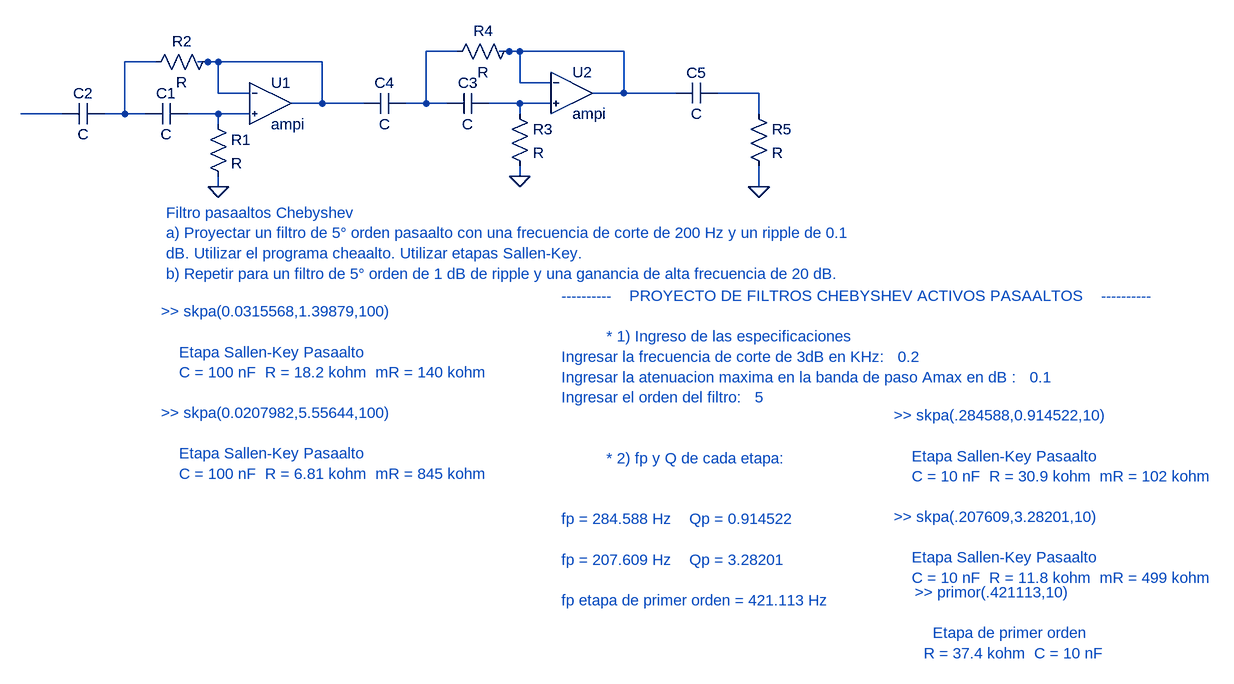
[diagram p0: schematic filtro_problema17_tp7.asc]
filtro_problema17_tp7.asc, the LTspice schematic file:
Version 4
SHEET 1 1504 724
WIRE 304 -208 256 -208
WIRE 384 -208 368 -208
WIRE 400 -208 384 -208
WIRE 560 -208 400 -208
WIRE -160 -192 -208 -192
WIRE -80 -192 -96 -192
WIRE -64 -192 -80 -192
WIRE 96 -192 -64 -192
WIRE 400 -160 400 -208
WIRE 448 -160 400 -160
WIRE -64 -144 -64 -192
WIRE -16 -144 -64 -144
WIRE 560 -144 560 -208
WIRE 560 -144 512 -144
WIRE 640 -144 560 -144
WIRE 768 -144 704 -144
WIRE 96 -128 96 -192
WIRE 96 -128 48 -128
WIRE 160 -128 96 -128
WIRE 256 -128 256 -208
WIRE 256 -128 224 -128
WIRE 288 -128 256 -128
WIRE 400 -128 352 -128
WIRE 448 -128 400 -128
WIRE -304 -112 -368 -112
WIRE -208 -112 -208 -192
WIRE -208 -112 -240 -112
WIRE -176 -112 -208 -112
WIRE -64 -112 -112 -112
WIRE -16 -112 -64 -112
WIRE 400 -112 400 -128
WIRE 768 -112 768 -144
WIRE -64 -96 -64 -112
WIRE 400 -16 400 -32
WIRE -64 0 -64 -16
WIRE 768 0 768 -32
FLAG -64 0 0
FLAG 400 -16 0
FLAG 768 0 0
SYMBOL Circuitos2\\ComponentesIdeales\\ampi 16 -192 R0
SYMATTR InstName U1
SYMBOL res -80 -112 R0
SYMATTR InstName R1
SYMBOL cap -112 -128 R90
WINDOW 0 0 32 VBottom 2
WINDOW 3 32 32 VTop 2
SYMATTR InstName C1
SYMBOL cap -240 -128 R90
WINDOW 0 0 32 VBottom 2
WINDOW 3 32 32 VTop 2
SYMATTR InstName C2
SYMBOL res -64 -208 R90
WINDOW 0 0 56 VBottom 2
WINDOW 3 32 56 VTop 2
SYMATTR InstName R2
SYMBOL Circuitos2\\ComponentesIdeales\\ampi 480 -208 R0
SYMATTR InstName U2
SYMBOL res 384 -128 R0
SYMATTR InstName R3
SYMBOL cap 352 -144 R90
WINDOW 0 0 32 VBottom 2
WINDOW 3 32 32 VTop 2
SYMATTR InstName C3
SYMBOL cap 224 -144 R90
WINDOW 0 0 32 VBottom 2
WINDOW 3 32 32 VTop 2
SYMATTR InstName C4
SYMBOL res 400 -224 R90
WINDOW 0 0 56 VBottom 2
WINDOW 3 32 56 VTop 2
SYMATTR InstName R4
SYMBOL cap 704 -160 R90
WINDOW 0 0 32 VBottom 2
WINDOW 3 32 32 VTop 2
SYMATTR InstName C5
SYMBOL res 752 -128 R0
SYMATTR InstName R5
TEXT -144 40 Left 2 ;Filtro pasaaltos Chebyshev\na) Proyectar un filtro de 5° orden pasaalto con una frecuencia de corte de 200 Hz y un ripple de 0.1\ndB. Utilizar el programa cheaalto. Utilizar etapas Sallen-Key.\nb) Repetir para un filtro de 5° orden de 1 dB de ripple y una ganancia de alta frecuencia de 20 dB.
TEXT -152 192 Left 2 ;>> skpa(0.0315568,1.39879,100)\n \n    Etapa Sallen-Key Pasaalto\n    C = 100 nF  R = 18.2 kohm  mR = 140 kohm\n \n>> skpa(0.0207982,5.55644,100)\n \n    Etapa Sallen-Key Pasaalto\n    C = 100 nF  R = 6.81 kohm  mR = 845 kohm
TEXT 464 168 Left 2 ;----------    PROYECTO DE FILTROS CHEBYSHEV ACTIVOS PASAALTOS    ----------\n \n          * 1) Ingreso de las especificaciones   \nIngresar la frecuencia de corte de 3dB en KHz:   0.2\nIngresar la atenuacion maxima en la banda de paso Amax en dB :   0.1\nIngresar el orden del filtro:   5\n \n\n          * 2) fp y Q de cada etapa: \n \n \nfp = 284.588 Hz    Qp = 0.914522  \n \nfp = 207.609 Hz    Qp = 3.28201  \n \nfp etapa de primer orden = 421.113 Hz
TEXT 976 352 Left 2 ;>> skpa(.284588,0.914522,10)\n \n    Etapa Sallen-Key Pasaalto\n    C = 10 nF  R = 30.9 kohm  mR = 102 kohm\n \n>> skpa(.207609,3.28201,10)\n \n    Etapa Sallen-Key Pasaalto\n    C = 10 nF  R = 11.8 kohm  mR = 499 kohm
TEXT 1008 624 Left 2 ;>> primor(.421113,10)\n \n    Etapa de primer orden\n  R = 37.4 kohm  C = 10 nF

The netlist it stands for:
* filtro_problema17_tp7.asc
XU1 N008 N004 N004 ampi Ren=1e9, Rsal=1, A=1e9  ; pins p n s
R1 N008 0 R
C1 N008 N003 C
C2 N003 N007 C
R2 N004 N003 R
XU2 N006 N002 N002 ampi Ren=1e9, Rsal=1, A=1e9  ; pins p n s
R3 N006 0 R
C3 N006 N001 C
C4 N001 N004 C
R4 N002 N001 R
C5 N005 N002 C
R5 N005 0 R
* Filtro pasaaltos Chebyshev
* a) Proyectar un filtro de 5° orden pasaalto con una frecuencia de corte de 200 Hz y un ripple de 0.1
* dB. Utilizar el programa cheaalto. Utilizar etapas Sallen-Key.
* b) Repetir para un filtro de 5° orden de 1 dB de ripple y una ganancia de alta frecuencia de 20 dB.
* >> skpa(0.0315568,1.39879,100)
*     Etapa Sallen-Key Pasaalto
*     C = 100 nF  R = 18.2 kohm  mR = 140 kohm
* >> skpa(0.0207982,5.55644,100)
*     Etapa Sallen-Key Pasaalto
*     C = 100 nF  R = 6.81 kohm  mR = 845 kohm
* ----------    PROYECTO DE FILTROS CHEBYSHEV ACTIVOS PASAALTOS    ----------
*           * 1) Ingreso de las especificaciones
* Ingresar la frecuencia de corte de 3dB en KHz:   0.2
* Ingresar la atenuacion maxima en la banda de paso Amax en dB :   0.1
* Ingresar el orden del filtro:   5
*           * 2) fp y Q de cada etapa:
* fp = 284.588 Hz    Qp = 0.914522
* fp = 207.609 Hz    Qp = 3.28201
* fp etapa de primer orden = 421.113 Hz
* >> skpa(.284588,0.914522,10)
*     Etapa Sallen-Key Pasaalto
*     C = 10 nF  R = 30.9 kohm  mR = 102 kohm
* >> skpa(.207609,3.28201,10)
*     Etapa Sallen-Key Pasaalto
*     C = 10 nF  R = 11.8 kohm  mR = 499 kohm
* >> primor(.421113,10)
*     Etapa de primer orden
*   R = 37.4 kohm  C = 10 nF
.lib ..\sym\Circuitos2\ComponentesIdeales\compoideales.lib
.backanno
.end